# EAGLE schematic 5v dc supply (EAGLE 9.6.2)
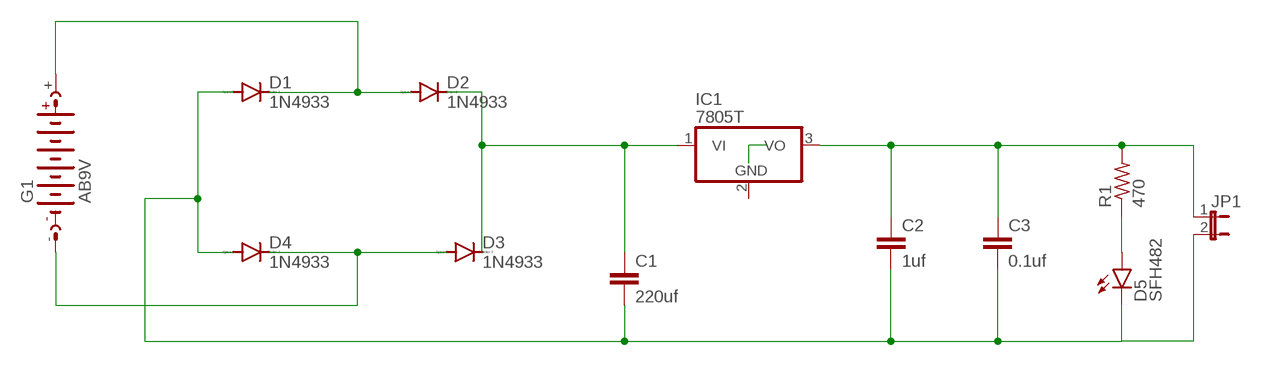
[diagram p0: schematic, sheet 1]

## Parts
C1  220uf  C2,5-3  [C2.5-3]
C2  1uf  C2,5-3  [C2.5-3]
C3  0.1uf  C2,5-3  [C2.5-3]
D1  1N4933  [DO41-10]
D2  1N4933  [DO41-10]
D3  1N4933  [DO41-10]
D4  1N4933  [DO41-10]
D5  SFH482  [SFH482]
G1  AB9V  [AB9V]
IC1  7805T  [TO220H]
JP1  JP1E  [JP1]
R1  470  R-US_0204/7  [0204/7]

## Nets
N$1: D5.A R1.1
N$2: C1.2 C2.2 C3.2 D1.A D4.A D5.K(C) JP1.2
N$3: D3.A D4.C G1.-
N$4: C1.1 D2.C D3.C IC1.1(VI)
N$5: D1.C D2.A G1.+
N$6: C2.1 C3.1 IC1.3(VO) JP1.1 R1.2
Unconnected: IC1.2(GND)

## Library data of the parts
C1-C3 = capacitor-wima:C: CAPACITOR naming: grid - package width
D1-D4 = diode:1N4933: DIODE fast recovery rectifier, 1A
D5 = led:SFH482: IR LED infrared emitting diode, Infineon
G1 = battery:AB9V: 9-V BATTERY CLIP
IC1 = linear:78*: Positive VOLTAGE REGULATOR Source: http://cache.national.com/ds/LM/LM78L05.pdf http://www.fairchildsemi.com/ds/LM/LM7805.pdf
JP1 = jumper:JP1E: JUMPER
R1 = rcl:R-US_: RESISTOR, American symbol; SPICEPREFIX: R